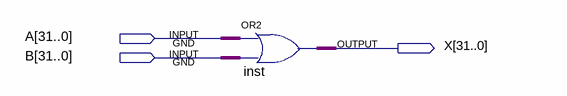
[diagram p0: schematic sheet]
// Quartus schematic or32.bdf as structural Verilog: 1 symbols, 3 pins
module or32 (
  input  [31:0] A,
  input  [31:0] B,
  output [31:0] X
);

  assign X = A | B;  // OR2 inst, 32 bits wide
endmodule
